# Altium schematic sheet Main.SchDoc
size A4; SheetNumber: 1; SheetTotal: 5
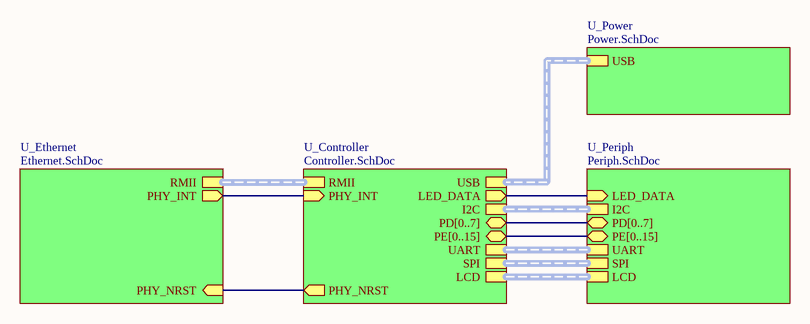
[diagram p0: Main.SchDoc]

## Sub-sheets
U_Controller = Controller.SchDoc: RMII (harness RMII), PHY_INT (in), PHY_NRST (out), USB (harness USB), LED_DATA (out), I2C (harness I2c), PD[0..7] (bidir), PE[0..15] (bidir), UART (harness UART), SPI (harness SPI), LCD (harness LCD)
U_Ethernet = Ethernet.SchDoc: RMII (harness RMII), PHY_INT (out), PHY_NRST (in)
U_Periph = Periph.SchDoc: I2C (harness I2c), LED_DATA (in), PD[0..7] (bidir), PE[0..15] (bidir), UART (harness UART), SPI (harness SPI), LCD (harness LCD)
U_Power = Power.SchDoc: USB (harness USB)

## Nets
(unnamed): sheet U_Ethernet/PHY_INT, sheet U_Controller/PHY_INT
(unnamed): sheet U_Ethernet/PHY_NRST, sheet U_Controller/PHY_NRST
(unnamed): sheet U_Periph/LED_DATA, sheet U_Controller/LED_DATA

## Buses and harness runs
bus sheet U_Controller/PD[0..7] = sheet U_Periph/PD[0..7]
bus sheet U_Controller/PE[0..15] = sheet U_Periph/PE[0..15]
harness sheet U_Controller/I2C = sheet U_Periph/I2C
harness sheet U_Controller/LCD = sheet U_Periph/LCD
harness sheet U_Controller/RMII = sheet U_Ethernet/RMII
harness sheet U_Controller/SPI = sheet U_Periph/SPI
harness sheet U_Controller/UART = sheet U_Periph/UART
harness sheet U_Controller/USB = sheet U_Power/USB